# Altium schematic sheet 1_Overveiw.SchDoc
size A; SheetNumber: 1; SheetTotal: 6
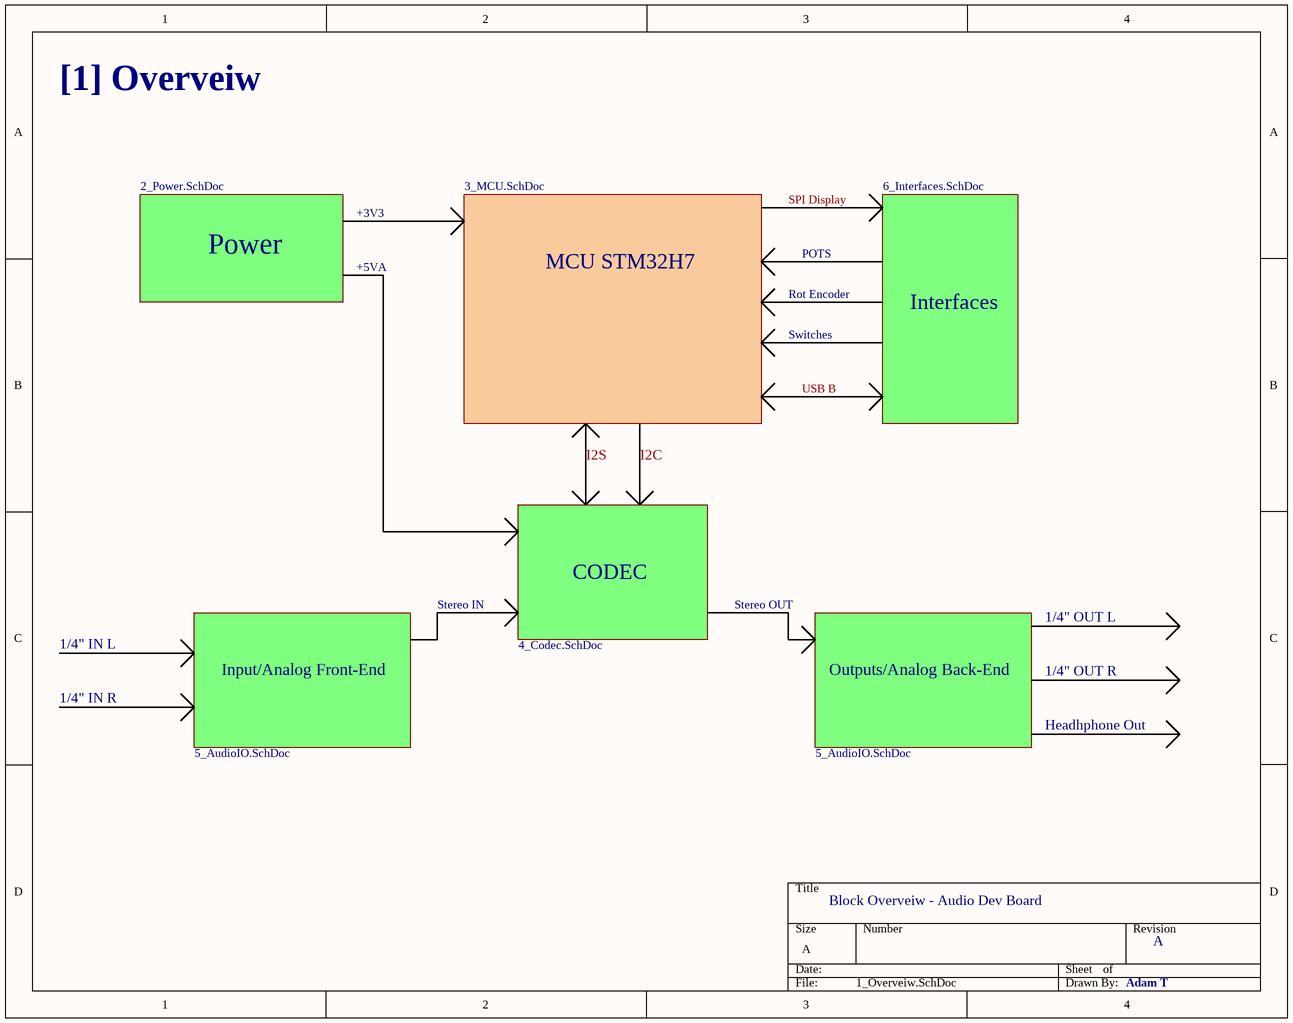
[diagram p0: 1_Overveiw.SchDoc]

## Sub-sheets
CODEC = 4_Codec.SchDoc: no entries
Input/Analog Front-End = 5_AudioIO.SchDoc: no entries
Interfaces = 6_Interfaces.SchDoc: no entries
MCU STM32H7 = 3_MCU.SchDoc: no entries
Outputs/Analog Back-End = 5_AudioIO.SchDoc: no entries
Power = 2_Power.SchDoc: no entries

## Notes on the sheet
- [1] Overveiw
- +3V3
- SPI Display
- +5VA
- Rot Encoder
- POTS
- Switches
- USB B
- I2S
- I2C
- Stereo IN
- Stereo OUT
- 1/4" OUT L
- 1/4" IN L
- 1/4" IN R
- 1/4" OUT R
- Headhphone Out
- Block Overveiw - Audio Dev Board
- A
- Adam T